# EAGLE design ps2amiga (EAGLE 6.5.0)
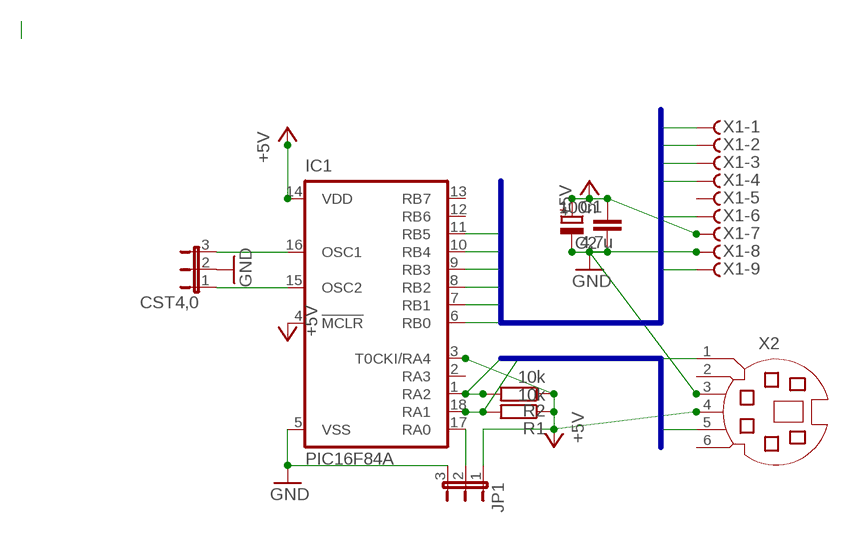
[diagram p0: schematic, sheet 1]

## Parts
C1  4,7u  CPOL-EUE2.5-6  [E2,5-6]
C2  100n  C-EU025-025X050  [C025-025X050]
CST4,0  JP2E  [JP2]
IC1  PIC16F84A  PIC16C84P  [DIL18]
JP1  JP2E  [JP2]
R1  10k  R-EU_0207/10  [0207/10]
R2  10k  R-EU_0207/10  [0207/10]
X1  F09HS  [F09H]
X2  MD06S  [MDIN06S]

## Nets
+5V: C1.+ C2.2 IC1.3(T0CKI/RA4) IC1.4(!MCLR) IC1.14(VDD) JP1.1 R1.1 R2.1 X1.7 X2.4
A1: IC1.7(RB1) X1.1
A2: IC1.6(RB0) X1.2
A3: IC1.8(RB2) X1.3
A4: IC1.9(RB3) X1.4
A5: IC1.11(RB5) X1.9
A6: IC1.10(RB4) X1.6
B1: IC1.18(RA1) R1.2 X2.1
B2: IC1.1(RA2) R2.2 X2.5
GND: C1.- C2.1 CST4,0.2 IC1.5(VSS) JP1.3 X1.8 X2.3
N$1: CST4,0.3 IC1.16(OSC1)
N$2: CST4,0.1 IC1.15(OSC2)
N$3: IC1.17(RA0) JP1.2
Unconnected: IC1.2(RA3) IC1.12(RB6) IC1.13(RB7) X1.5 X2.2 X2.6

## Buses
A[1..6]
B[1..2]

## Library data of the parts
C1 = rcl:CPOL-EU: POLARIZED CAPACITOR, European symbol
C2 = rcl:C-EU: CAPACITOR, European symbol
CST4,0 JP1 = jumper:JP2E: JUMPER
IC1 = microchip:PIC16C84: MICROCONTROLLER EPROM/ROM-based
R1 R2 = rcl:R-EU_: RESISTOR, European symbol
X1 = con-subd:F09?S: SUB-D
X2 = con-yamaichi:MD06S: YAMAICHI CONNECTOR; OC_FARNELL: unknown; OC_NEWARK: unknown

## Board
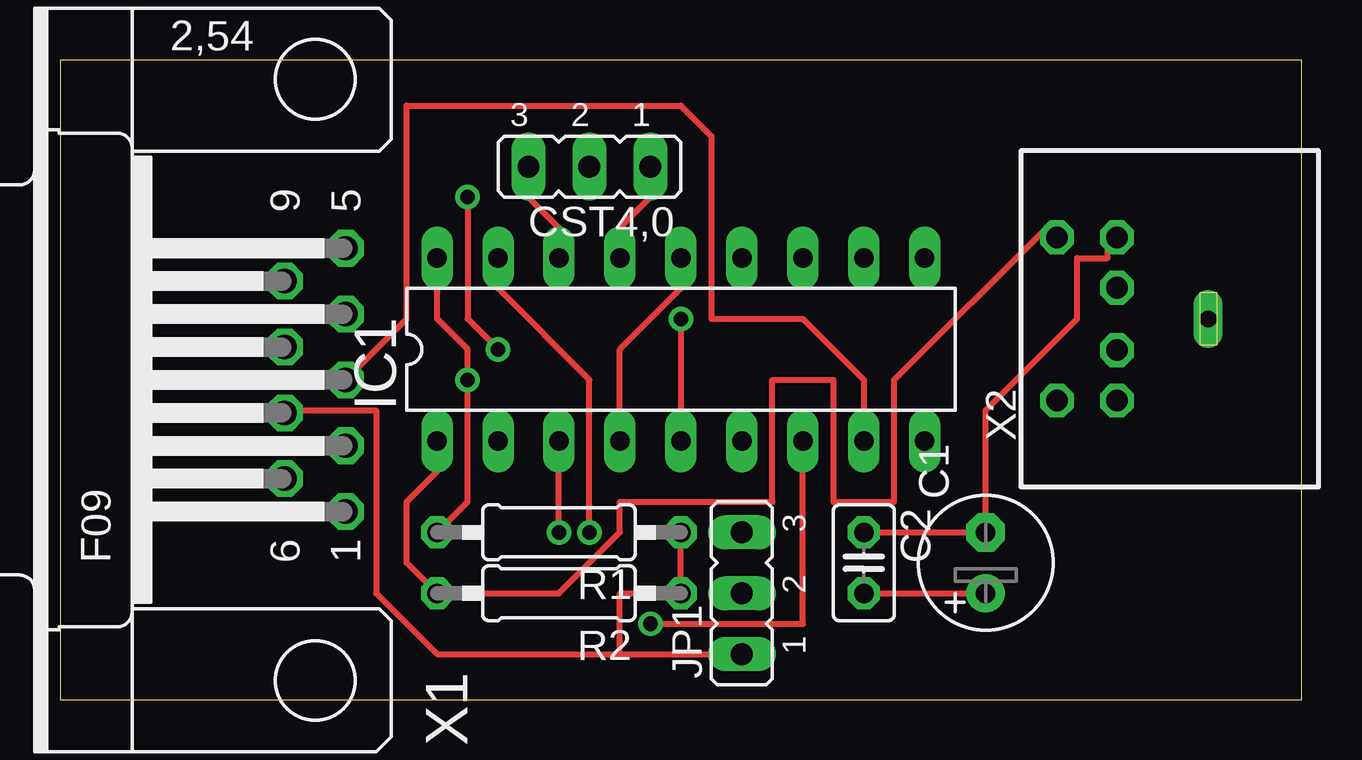
[diagram p1: board, top side]
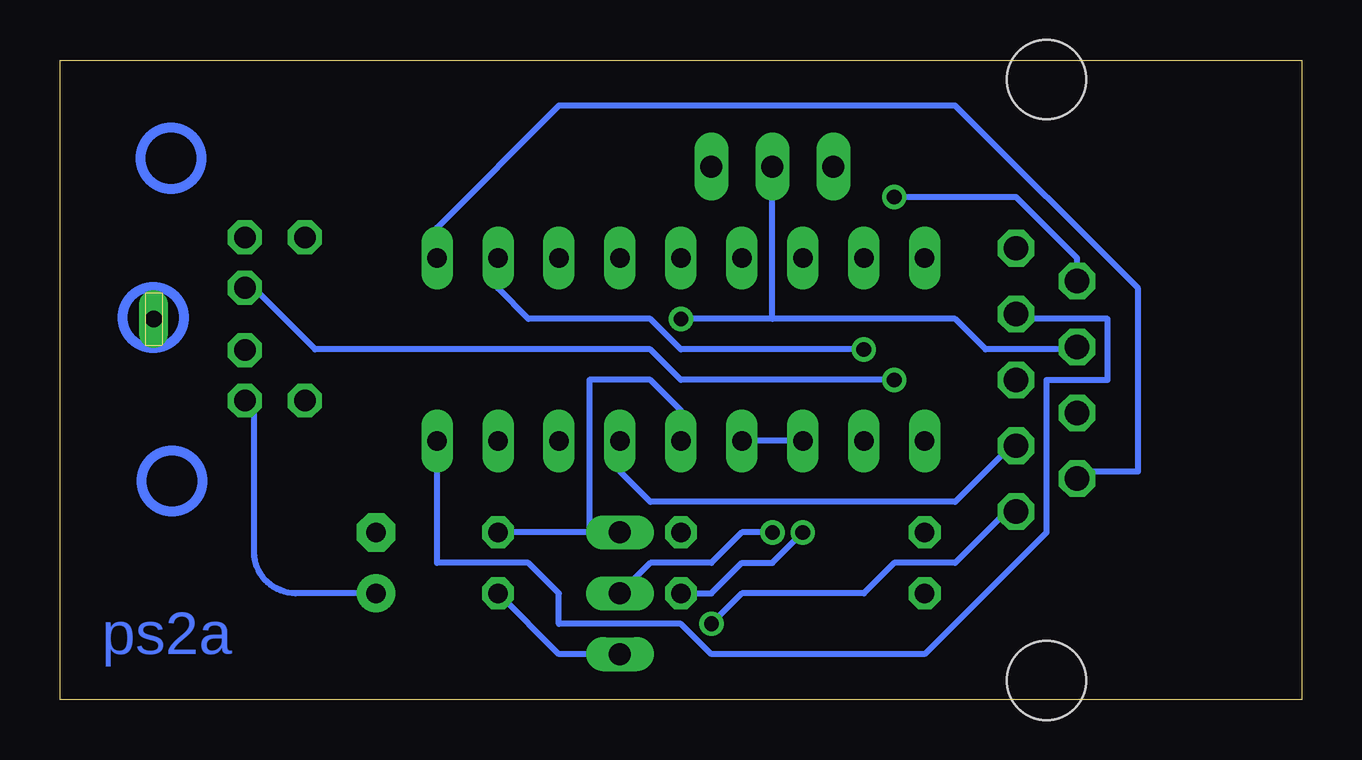
[diagram p2: board, bottom side, seen from below]

Size 51.74 x 26.66 mm. Coordinates in mm from the lower left corner, seen from the top.
Outline: 0,0 51.74,0 51.74,26.66 0,26.66 0,0
Copper layers (1*16): Top 0.035mm / dielectric 1.5mm / Bottom 0.035mm
Design rules "default": minimum track width 10mil, minimum drill 24mil, track to track 8mil, track to pad 8mil, pad to pad 8mil, via to via 8mil, smd to smd 8mil, copper to edge 40mil, drill to drill 8mil, minimum pad ring 10mil, minimum via ring 8mil, stop-mask expansion 4mil, vias tented up to drill 0mil, thermal gap 10mil

### Footprints (pad centres in the part's own frame; a part is rotated, then mirrored left to right if it is on the bottom)
E2,5-6 = drill 0.813 pad 1.6: + -1.27,0 | drill 0.813 pad 1.6 octagon: - 1.27,0
C025-025X050 = drill 0.813 octagon: 1 -1.27,0; 2 1.27,0
JP2 = drill 0.914 long: 1 -2.54,0; 2 0,0; 3 2.54,0
DIL18 = drill 0.813 long: 1 -10.16,-3.81; 2 -7.62,-3.81; 3 -5.08,-3.81; 4 -2.54,-3.81; 5 0,-3.81; 6 2.54,-3.81; 7 5.08,-3.81; 8 7.62,-3.81; 9 10.16,-3.81; 10 10.16,3.81; 11 7.62,3.81; 12 5.08,3.81; 13 2.54,3.81; 14 0,3.81; 15 -2.54,3.81; 16 -5.08,3.81; 17 -7.62,3.81; 18 -10.16,3.81
0207/10 = drill 0.813 octagon: 1 -5.08,0; 2 5.08,0
F09H = drill 1.016 octagon: 1 -5.486,-1.27; 2 -2.743,-1.27; 3 0,-1.27; 4 2.743,-1.27; 5 5.486,-1.27; 6 -4.115,1.27; 7 -1.372,1.27; 8 1.372,1.27; 9 4.115,1.27 | hole 3.302: -12.522,0; 12.522,0
MDIN06S = drill 0.9 octagon: 1 1.3,8.5; 2 -1.3,8.5; 3 3.4,8.5; 4 -3.4,8.5; 5 3.4,11; 6 -3.4,11 | drill 0.7 long: M 0,4.7

### Placement (x,y rotation side)
C1  38.57,5.71 90 top
C2  33.49,5.71 270 top
CST4,0  22.06,22.22 180 top
IC1  25.87,14.6 0 top
JP1  28.41,4.44 90 top
R1  20.79,6.98 180 top
R2  20.79,4.44 180 top
X1  10.63,13.33 90 top
X2  52.54,15.87 90 top

### Tracks (layer width: path | path; a pad name or v marks a point on that pad's centre or on a via)
+5V  (via drill 0.61)
  Top 0.254: IC1.14 25.87,17.14 23.33,14.6 IC1.4 | R1.1 R2.1 23.33,4.44 23.33,1.9 | 23.33,1.9 15.71,1.9 13.17,4.44 13.17,12.06 9.36,12.06 X1.7 | 23.33,1.9 JP1.1 | v20.79,6.98 IC1.3 | C2.2 C1.+
  Bottom 0.254: C1.+ 41.92,4.44 arc90 43.65,6.17 43.65,12.06 X2.4 | IC1.3 IC1.4 | C2.2 30.95,1.9 JP1.1 | v20.79,6.98 22.06,5.71 23.33,5.71 24.6,4.44 R2.1
A1  (via drill 0.61)
  Top 0.254: v24.6,3.17 30.95,3.17 IC1.7
  Bottom 0.254: v24.6,3.17 23.33,4.44 18.25,4.44 16.98,5.71 14.44,5.71 11.9,8.25 X1.1
A2
  Bottom 0.254: IC1.6 28.41,9.52 27.14,8.25 14.44,8.25 11.9,10.79 X1.2
A3
  Top 0.254: X1.3 14.44,15.87 14.44,24.76 25.87,24.76 27.14,23.49 27.14,15.87 30.95,15.87 33.49,13.33 IC1.8
A4
  Bottom 0.254: IC1.9 36.03,5.71 32.22,5.71 30.95,4.44 30.95,3.17 25.87,3.17 24.6,1.9 15.71,1.9 10.63,6.98 10.63,13.33 8.09,13.33 8.09,15.87 11.9,15.87 X1.4
A5  (via drill 0.61)
  Top 0.254: v18.25,14.6 16.98,15.87 v16.98,20.95
  Bottom 0.254: v18.25,14.6 25.87,14.6 27.14,15.87 32.22,15.87 33.49,17.14 IC1.11 | v16.98,20.95 11.9,20.95 9.36,18.41 X1.9 9.36,17.14
A6
  Bottom 0.254: IC1.10 36.03,19.68 30.95,24.76 14.44,24.76 6.82,17.14 6.82,9.52 9.36,9.52 X1.6
B1  (via drill 0.61)
  Top 0.254: R1.2 16.98,8.25 v16.98,13.33 16.98,14.6 15.71,15.87 IC1.18
  Bottom 0.254: v16.98,13.33 25.87,13.33 27.14,14.6 41.11,14.6 43.65,17.14 X2.1
B2
  Top 0.254: IC1.1 15.71,9.52 14.44,8.25 14.44,5.71 R2.2 20.79,4.44 23.33,6.98 23.33,8.25 29.68,8.25 29.68,13.33 32.22,13.33 32.22,8.25 34.76,8.25 34.76,13.33 41.11,19.68 X2.5
GND  (via drill 0.61)
  Top 0.254: X2.3 43.65,19.68 43.65,18.41 42.38,18.41 42.38,15.87 38.57,12.06 C1.- C2.1 | v25.87,15.87 IC1.5
  Bottom 0.254: 22.06,15.87 14.44,15.87 13.17,14.6 9.36,14.6 X1.8 | 22.06,15.87 CST4,0.2 | 29.68,6.98 C2.1 | 29.68,6.98 29.68,13.33 27.14,13.33 25.87,12.06 IC1.5 | 29.68,6.98 JP1.3 | 22.06,15.87 v25.87,15.87
N$1
  Top 0.254: IC1.16 20.79,19.68 19.52,20.95 CST4,0.3
N$2
  Top 0.254: IC1.15 23.33,19.68 24.6,20.95 CST4,0.1
N$3  (via drill 0.61)
  Top 0.254: v22.06,6.98 22.06,13.33 18.25,17.14 IC1.17
  Bottom 0.254: v22.06,6.98 23.33,6.98 24.6,5.71 27.14,5.71 JP1.2
(copper drawn outside any net)
  shapes: Bottom circle x3

### Text on the board
Bottom: ps2a